# Altium project POP.PrjPcb
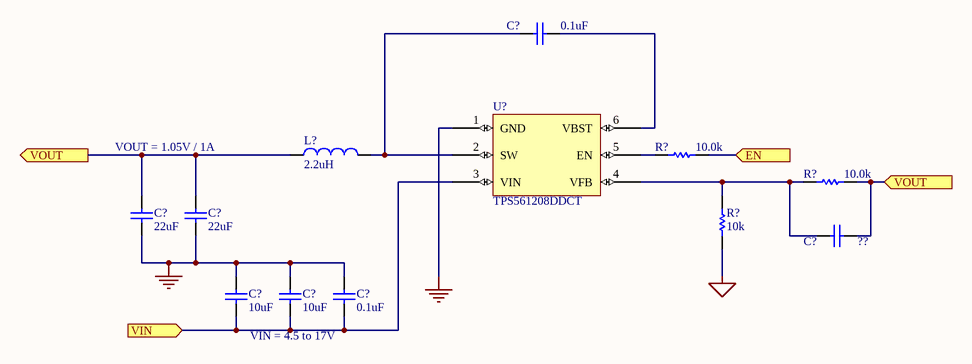
[diagram p0: POP.SchDoc]
1 sheet, 12 parts. Net scope: flat (ports and power ports of the same name join across sheets).

## Sheet POP.SchDoc
size A4

### Parts
(Parts that share a designator on the sheet are numbered #1, #2 ... from top to bottom, then left to right.)
C?#1  0.1uF  [2012/0805]
C?#2  22uF  [2012/0805]
C?#3  22uF  [2012/0805]
C?#4  ??  [2012/0805]
C?#5  10uF  [2012/0805]
C?#6  10uF  [2012/0805]
C?#7  0.1uF  [2012/0805]
L?  2.2uH  [INDC1608AN]
R?#1  10.0k  [1608/0603]
R?#2  10.0k  [1608/0603]
R?#3  10k  [1608/0603]
U?  TPS561208DDCT

### Ports
EN (in), VIN (in), VOUT (in), VOUT (out)

### Nets
GND: C?#2.1 C?#3.1 C?#5.2 C?#6.2 C?#7.2 R?#3.1 U?.1(GND)
NetC?#1_1: C?#1.1 L?.2 U?.2(SW)
NetC?#1_2: C?#1.2 U?.6(VBST)
NetC?#2_2: C?#2.2 C?#3.2 C?#4.1 L?.1 R?#2.2 ; port VOUT
NetC?#4_2: C?#4.2 R?#2.1 R?#3.2 U?.4(VFB)
NetC?#5_1: C?#5.1 C?#6.1 C?#7.1 U?.3(VIN) ; port VIN
NetR?#1_1: R?#1.1 U?.5(EN)
NetR?#1_2: R?#1.2 ; port EN

### Notes on the sheet
- VOUT = 1.05V / 1A
- (near C?#6) VIN = 4.5 to 17V

### Library data of the parts
C?#1-C?#7 = Capacitor: Value: 100pF; Published: 8-Jun-2000; LatestRevisionDate: 17-Jul-2002; LatestRevisionNote: Re-released for DXP Platform.; PackageReference: RAD-0.3; Publisher: Altium Limited; PackageDescription: Radial Cap, Thru-Hole; 2 Leads; 0.3 in Pin Spacing
L? = Inductor: Code_IEC: 1005; Value: 10mH; Published: 8-Jun-2000; LatestRevisionDate: 29-May-2009; LatestRevisionNote: IPC-7351 Footprint Added.; PackageReference: 0402-A; Publisher: Altium Limited; PackageDescription: Chip Inductor; Code_JEITA: 0402
R?#1-R?#3 = Resistor: Value: 1K; Published: 8-Jun-2000; LatestRevisionDate: 17-Jul-2002; LatestRevisionNote: Re-released for DXP Platform.; PackageReference: AXIAL-0.3; Publisher: Altium Limited; PackageDescription: Axial Device, Thru-Hole; 2 Leads; 0.3 in Pin Spacing
U? = TPS561208DDCT: Voltage Regulator